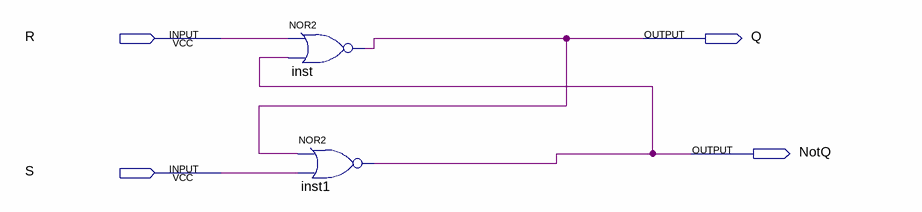
[diagram p0: schematic sheet]
// Quartus schematic srlatch.bdf as structural Verilog: 2 symbols, 4 pins
module srlatch (
  input  R,
  input  S,
  output Q,
  output NotQ
);

  nor inst (Q, R, NotQ);
  nor inst1 (NotQ, Q, S);
endmodule
